# Altium schematic sheet Power.SchDoc
size A4
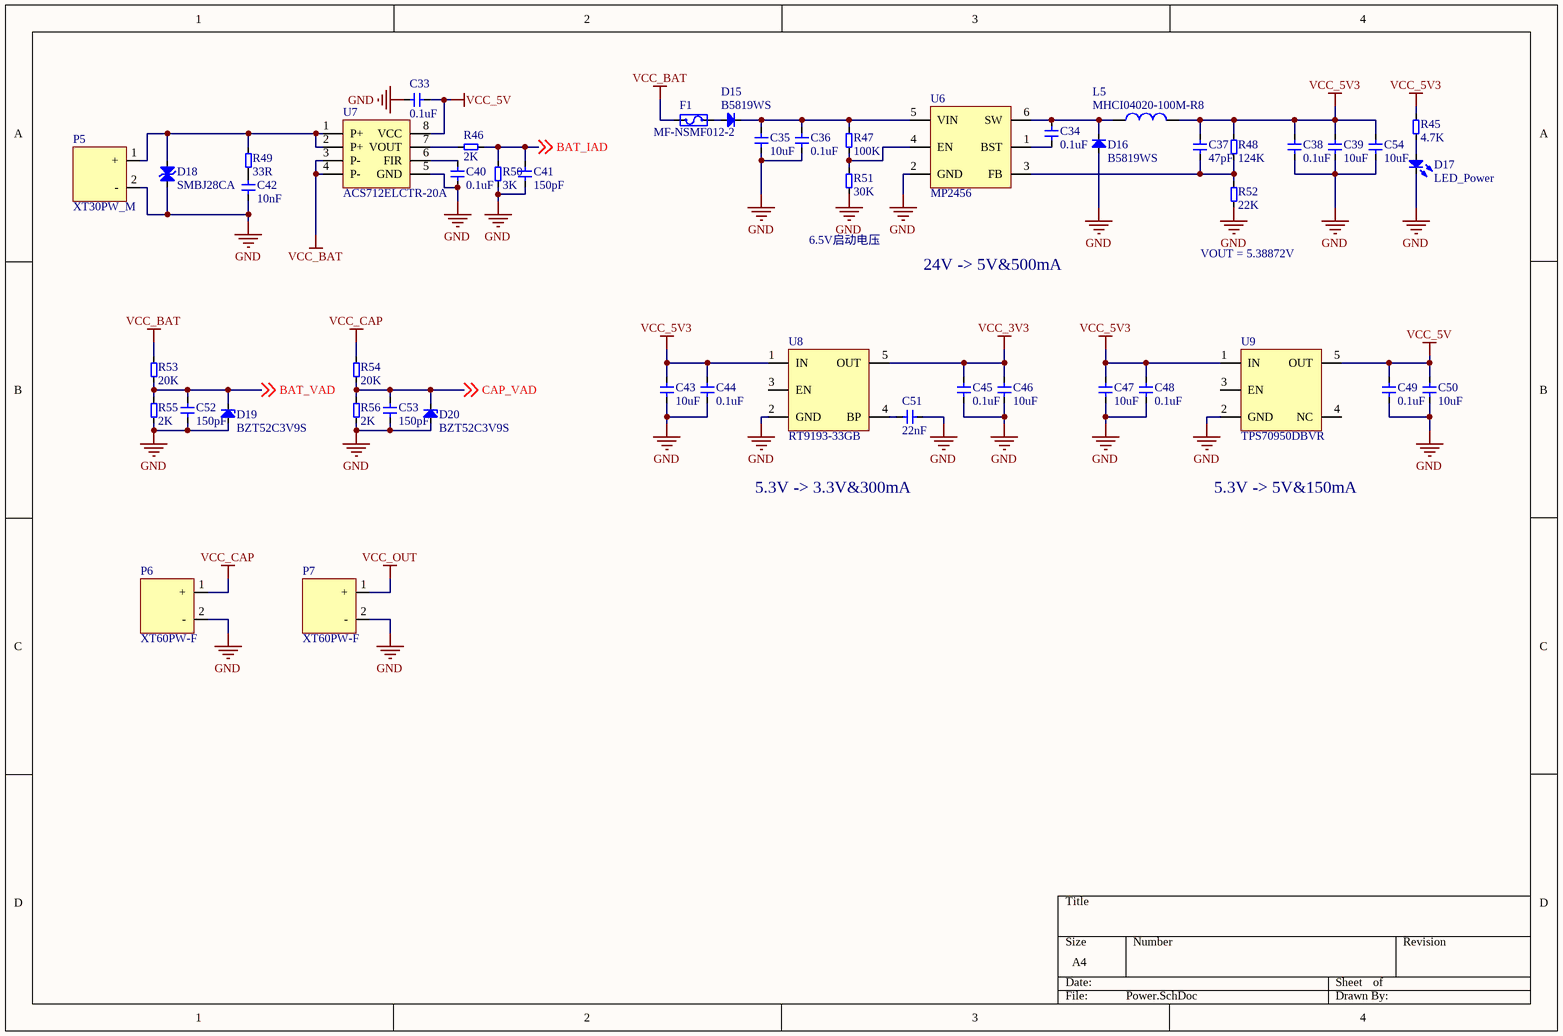
[diagram p0: Power.SchDoc]

## Parts
C33  0.1uF  [CAP-0603-L]
C34  0.1uF  [CAP-0603-L]
C35  10uF  [CAP-0805-L]
C36  0.1uF  [CAP-0603-L]
C37  47pF  [CAP-0603-L]
C38  0.1uF  [CAP-0603-L]
C39  10uF  [CAP-0805-L]
C40  0.1uF  [CAP-0603-L]
C41  150pF  [CAP-0603-L]
C42  10nF  [CAP-0805-L]
C43  10uF  [CAP-0805-L]
C44  0.1uF  [CAP-0603-L]
C45  0.1uF  [CAP-0603-L]
C46  10uF  [CAP-0805-L]
C47  10uF  [CAP-0805-L]
C48  0.1uF  [CAP-0603-L]
C49  0.1uF  [CAP-0603-L]
C50  10uF  [CAP-0805-L]
C51  22nF  [CAP-0603-L]
C52  150pF  [CAP-0603-L]
C53  150pF  [CAP-0603-L]
C54  10uF  [CAP-0805-L]
D15  B5819WS  [SOD_323]
D16  B5819WS  [SOD_323]
D17  LED_Power  [LED_0603-L]
D18  SMBJ28CA  [Diode_SMA]
D19  BZT52C3V9S  [SOD_323]
D20  BZT52C3V9S  [SOD_323]
F1  MF-NSMF012-2  [FUSE_1206]
L5  MHCI04020-100M-R8  [L-0420]
P5  XT30PW_M  [XT30PW-M]
P6  XT60PW-F  [XT60PW-M]
P7  XT60PW-F  [XT60PW-F]
R45  4.7K  [R-0603-L]
R46  2K  [R-0603-L]
R47  100K  [R-0603-L]
R48  124K  [R-0603-L]
R49  33R  [R-0805-L]
R50  3K  [R-0603-L]
R51  30K  [R-0603-L]
R52  22K  [R-0603-L]
R53  20K  [R-0603-L]
R54  20K  [R-0603-L]
R55  2K  [R-0603-L]
R56  2K  [R-0603-L]
U6  MP2456  [SOT-23-6]
U7  ACS712ELCTR-20A  [SOIC_8]
U8  RT9193-33GB  [SOT-23-5]
U9  TPS70950DBVR  [SOT-23-5]

## Nets
GND: C33.2 C35.1 C36.1 C38.1 C39.1 C40.1 C41.1 C42.1 C43.1 C44.1 C45.1 C46.1 C47.1 C48.1 C49.1 C50.1 C51.1 C52.1 C53.1 C54.1 D16.1 D17.2 D18.1 D19.1 D20.1 P5.2(-) P6.2(-) P7.2(-) R50.1 R51.1 R52.1 R55.1 R56.1 U6.2(GND) U7.5(GND) U8.2(GND) U9.2(GND)
VCC_3V3: C45.2 C46.2 U8.5(OUT)
VCC_5V: C33.1 C49.2 C50.2 U7.8(VCC) U9.5(OUT)
VCC_5V3: C37.2 C38.2 C39.2 C43.2 C44.2 C47.2 C48.2 C54.2 L5.2 R45.2 R48.2 U8.1(IN) U9.1(IN)
VCC_BAT: F1.1 R53.2 U7.3(P-) U7.4(P-)
VCC_CAP: P6.1(+) R54.2
VCC_OUT: P7.1(+)
BAT_IAD: C41.2 R46.1 R50.2 ; off-sheet BAT_IAD
BAT_VAD: C52.2 D19.2 R53.1 R55.2 ; off-sheet BAT_VAD
CAP_VAD: C53.2 D20.2 R54.1 R56.2 ; off-sheet CAP_VAD
NetC34_1: C34.1 U6.1(BST)
NetC34_2: C34.2 D16.2 L5.1 U6.6(SW)
NetC35_2: C35.2 C36.2 D15.2 R47.2 U6.5(VIN)
NetC37_1: C37.1 R48.1 R52.2 U6.3(FB)
NetC40_2: C40.2 U7.6(FIR)
NetC42_2: C42.2 R49.1
NetC51_2: C51.2 U8.4(BP)
NetD15_1: D15.1 F1.2
NetD17_1: D17.1 R45.1
NetD18_2: D18.2 P5.1(+) R49.2 U7.1(P+) U7.2(P+)
NetR46_2: R46.2 U7.7(VOUT)
NetR47_1: R47.1 R51.2 U6.4(EN)

Not connected (* = marked no-connect by the designer): U8 3(EN); U9 3(EN) 4(NC)

## Notes on the sheet
- (near R51) 6.5V启动电压
- 24V -> 5V&500mA
- (near R52) VOUT = 5.38872V
- 5.3V -> 3.3V&300mA
- 5.3V -> 5V&150mA

## Library data of the parts
C33-C54 = CAP
D15 D16 = Diode
D17 = LED
D18 = TVS_C
D19 D20 = Diode_ZD
F1 = Fuse
L5 = Inductor: 电感
P5 = XT30
P6 P7 = XT60
R45-R56 = Res
U7 = ACS712ELCTR: 电流测量芯片
U8 = RT9193: LDO
U9 = TPS709: 具有使能端的 150-mA 超低 Iq LDO